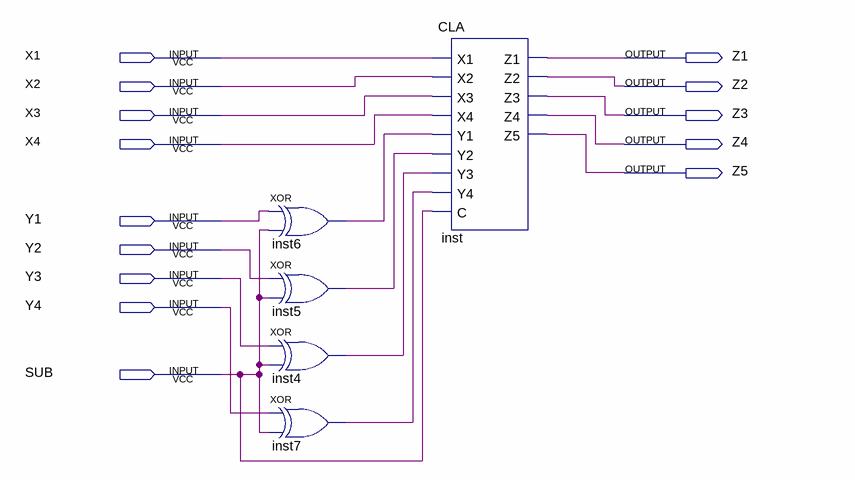
[diagram p0: schematic sheet]
// Quartus schematic ALU_CLA.bdf as structural Verilog: 5 symbols, 14 pins
module ALU_CLA (
  input  X1,
  input  X2,
  input  X3,
  input  X4,
  input  Y1,
  input  Y2,
  input  Y3,
  input  Y4,
  input  SUB,
  output Z1,
  output Z2,
  output Z3,
  output Z4,
  output Z5
);

  wire inst4_out, inst5_out, inst6_out, inst7_out;

  xor inst6 (inst6_out, Y1, SUB);
  xor inst5 (inst5_out, Y2, SUB);
  xor inst4 (inst4_out, Y3, SUB);
  xor inst7 (inst7_out, Y4, SUB);
  CLA inst (
    .X1(X1), .X2(X2), .X3(X3), .X4(X4), .Y1(inst6_out), .Y2(inst5_out), .Y3(inst4_out), .Y4(inst7_out),
    .C(SUB), .Z1(Z1), .Z2(Z2), .Z3(Z3), .Z4(Z4), .Z5(Z5));
endmodule
